# Altium schematic sheet PL_DDR4.SchDoc
size A3
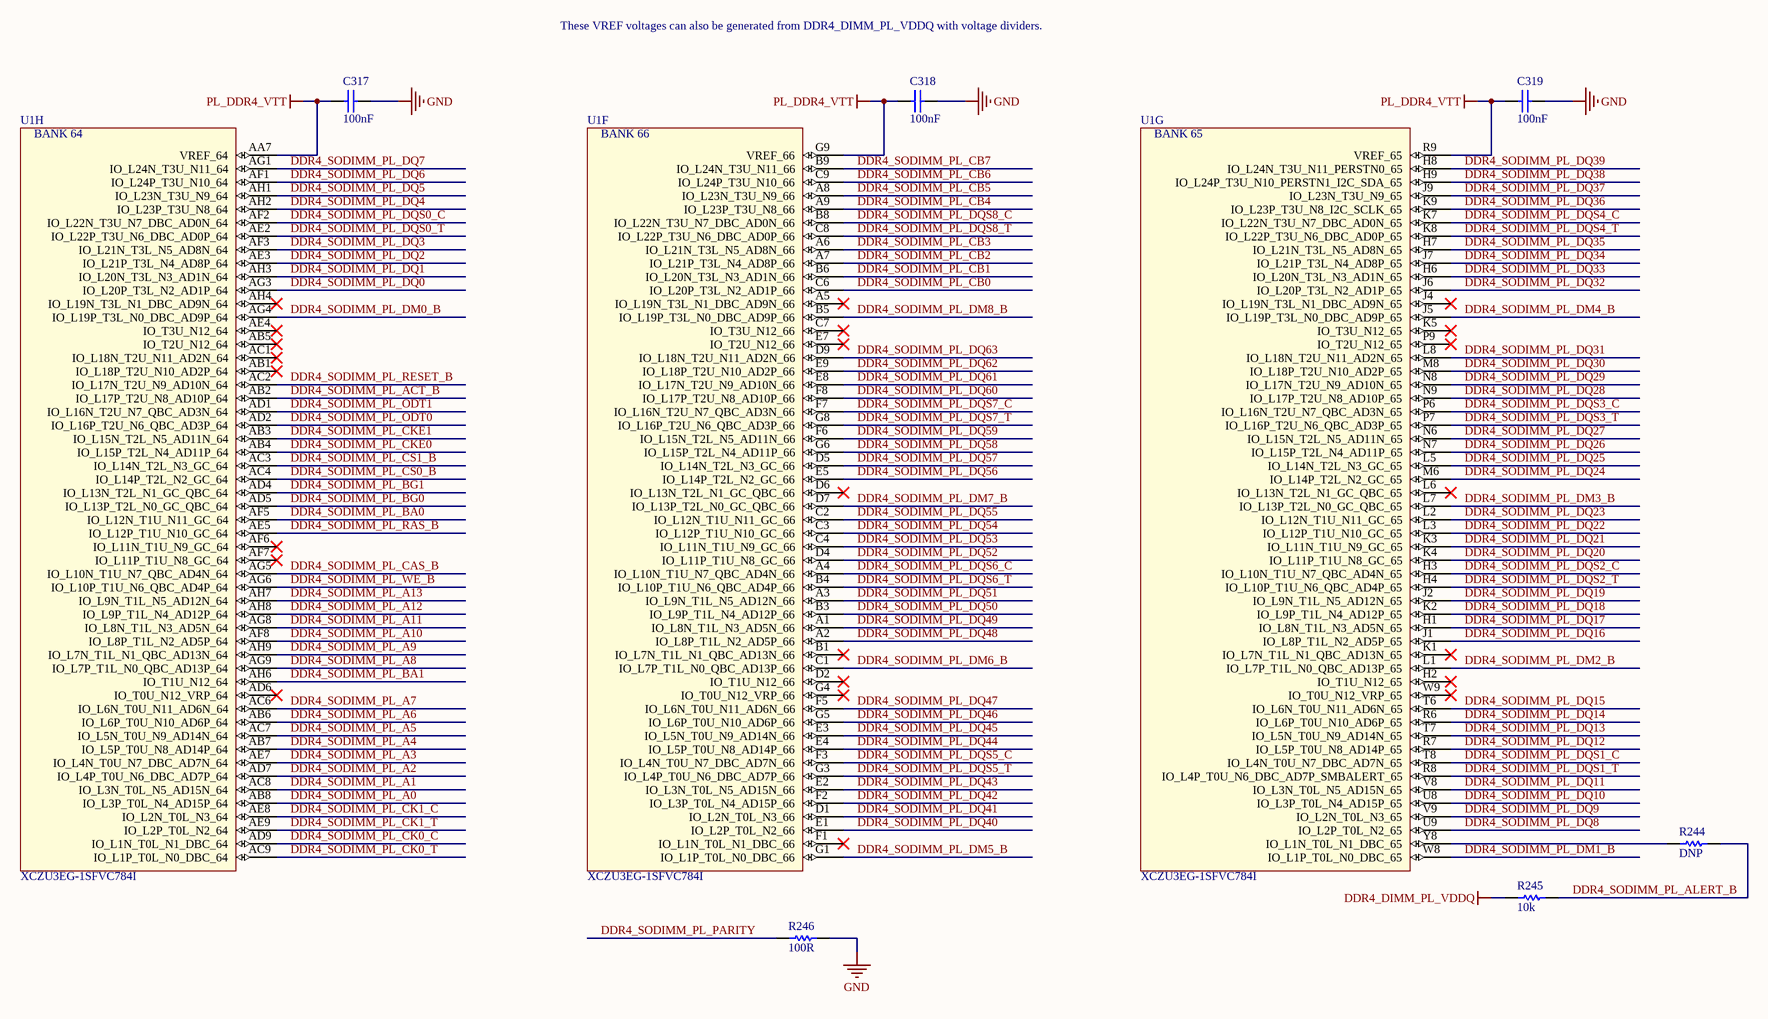
[diagram p0: PL_DDR4.SchDoc]

## Parts
C317  100nF  [CAPC1005L_0402]
C318  100nF  [CAPC1005L_0402]
C319  100nF  [CAPC1005L_0402]
R244  value DNP  [RESC1005L_0402]  (hidden comment: RES0402)
R245  value 10k  [RESC1005L_0402]  (hidden comment: RES0402_10K_0W1_05T)
R246  value 100R  [RESC1005L_0402]  (hidden comment: RES0402_100R_0W1_1T)
U1  XCZU3EG-1SFVC784I  [BGA784x28]  (parts F,G,H of 22)

## Nets
DDR4_DIMM_PL_VDDQ: R245.2
GND: C317.1 C318.1 C319.1 R246.2
PL_DDR4_VTT: C317.2 C318.2 C319.2 U1.AA7(VREF_64) U1.G9(VREF_66) U1.R9(VREF_65)
DDR4_SODIMM_PL_A0: U1.AB8(IO_L3P_T0L_N4_AD15P_64)
DDR4_SODIMM_PL_A1: U1.AC8(IO_L3N_T0L_N5_AD15N_64)
DDR4_SODIMM_PL_A2: U1.AD7(IO_L4P_T0U_N6_DBC_AD7P_64)
DDR4_SODIMM_PL_A3: U1.AE7(IO_L4N_T0U_N7_DBC_AD7N_64)
DDR4_SODIMM_PL_A4: U1.AB7(IO_L5P_T0U_N8_AD14P_64)
DDR4_SODIMM_PL_A5: U1.AC7(IO_L5N_T0U_N9_AD14N_64)
DDR4_SODIMM_PL_A6: U1.AB6(IO_L6P_T0U_N10_AD6P_64)
DDR4_SODIMM_PL_A7: U1.AC6(IO_L6N_T0U_N11_AD6N_64)
DDR4_SODIMM_PL_A8: U1.AG9(IO_L7P_T1L_N0_QBC_AD13P_64)
DDR4_SODIMM_PL_A9: U1.AH9(IO_L7N_T1L_N1_QBC_AD13N_64)
DDR4_SODIMM_PL_A10: U1.AF8(IO_L8P_T1L_N2_AD5P_64)
DDR4_SODIMM_PL_A11: U1.AG8(IO_L8N_T1L_N3_AD5N_64)
DDR4_SODIMM_PL_A12: U1.AH8(IO_L9P_T1L_N4_AD12P_64)
DDR4_SODIMM_PL_A13: U1.AH7(IO_L9N_T1L_N5_AD12N_64)
DDR4_SODIMM_PL_ACT_B: U1.AB2(IO_L17P_T2U_N8_AD10P_64)
DDR4_SODIMM_PL_ALERT_B: R244.2 R245.1
DDR4_SODIMM_PL_BA0: U1.AF5(IO_L12N_T1U_N11_GC_64)
DDR4_SODIMM_PL_BA1: U1.AH6(IO_T1U_N12_64)
DDR4_SODIMM_PL_BG0: U1.AD5(IO_L13P_T2L_N0_GC_QBC_64)
DDR4_SODIMM_PL_BG1: U1.AD4(IO_L13N_T2L_N1_GC_QBC_64)
DDR4_SODIMM_PL_CAS_B: U1.AG5(IO_L10N_T1U_N7_QBC_AD4N_64)
DDR4_SODIMM_PL_CB0: U1.C6(IO_L20P_T3L_N2_AD1P_66)
DDR4_SODIMM_PL_CB1: U1.B6(IO_L20N_T3L_N3_AD1N_66)
DDR4_SODIMM_PL_CB2: U1.A7(IO_L21P_T3L_N4_AD8P_66)
DDR4_SODIMM_PL_CB3: U1.A6(IO_L21N_T3L_N5_AD8N_66)
DDR4_SODIMM_PL_CB4: U1.A9(IO_L23P_T3U_N8_66)
DDR4_SODIMM_PL_CB5: U1.A8(IO_L23N_T3U_N9_66)
DDR4_SODIMM_PL_CB6: U1.C9(IO_L24P_T3U_N10_66)
DDR4_SODIMM_PL_CB7: U1.B9(IO_L24N_T3U_N11_66)
DDR4_SODIMM_PL_CK0_C: U1.AD9(IO_L1N_T0L_N1_DBC_64)
DDR4_SODIMM_PL_CK0_T: U1.AC9(IO_L1P_T0L_N0_DBC_64)
DDR4_SODIMM_PL_CK1_C: U1.AE8(IO_L2N_T0L_N3_64)
DDR4_SODIMM_PL_CK1_T: U1.AE9(IO_L2P_T0L_N2_64)
DDR4_SODIMM_PL_CKE0: U1.AB4(IO_L15P_T2L_N4_AD11P_64)
DDR4_SODIMM_PL_CKE1: U1.AB3(IO_L15N_T2L_N5_AD11N_64)
DDR4_SODIMM_PL_CS0_B: U1.AC4(IO_L14P_T2L_N2_GC_64)
DDR4_SODIMM_PL_CS1_B: U1.AC3(IO_L14N_T2L_N3_GC_64)
DDR4_SODIMM_PL_DM0_B: U1.AG4(IO_L19P_T3L_N0_DBC_AD9P_64)
DDR4_SODIMM_PL_DM1_B: U1.W8(IO_L1P_T0L_N0_DBC_65)
DDR4_SODIMM_PL_DM2_B: U1.L1(IO_L7P_T1L_N0_QBC_AD13P_65)
DDR4_SODIMM_PL_DM3_B: U1.L7(IO_L13P_T2L_N0_GC_QBC_65)
DDR4_SODIMM_PL_DM4_B: U1.J5(IO_L19P_T3L_N0_DBC_AD9P_65)
DDR4_SODIMM_PL_DM5_B: U1.G1(IO_L1P_T0L_N0_DBC_66)
DDR4_SODIMM_PL_DM6_B: U1.C1(IO_L7P_T1L_N0_QBC_AD13P_66)
DDR4_SODIMM_PL_DM7_B: U1.D7(IO_L13P_T2L_N0_GC_QBC_66)
DDR4_SODIMM_PL_DM8_B: U1.B5(IO_L19P_T3L_N0_DBC_AD9P_66)
DDR4_SODIMM_PL_DQ0: U1.AG3(IO_L20P_T3L_N2_AD1P_64)
DDR4_SODIMM_PL_DQ1: U1.AH3(IO_L20N_T3L_N3_AD1N_64)
DDR4_SODIMM_PL_DQ2: U1.AE3(IO_L21P_T3L_N4_AD8P_64)
DDR4_SODIMM_PL_DQ3: U1.AF3(IO_L21N_T3L_N5_AD8N_64)
DDR4_SODIMM_PL_DQ4: U1.AH2(IO_L23P_T3U_N8_64)
DDR4_SODIMM_PL_DQ5: U1.AH1(IO_L23N_T3U_N9_64)
DDR4_SODIMM_PL_DQ6: U1.AF1(IO_L24P_T3U_N10_64)
DDR4_SODIMM_PL_DQ7: U1.AG1(IO_L24N_T3U_N11_64)
DDR4_SODIMM_PL_DQ8: U1.U9(IO_L2P_T0L_N2_65)
DDR4_SODIMM_PL_DQ9: U1.V9(IO_L2N_T0L_N3_65)
DDR4_SODIMM_PL_DQ10: U1.U8(IO_L3P_T0L_N4_AD15P_65)
DDR4_SODIMM_PL_DQ11: U1.V8(IO_L3N_T0L_N5_AD15N_65)
DDR4_SODIMM_PL_DQ12: U1.R7(IO_L5P_T0U_N8_AD14P_65)
DDR4_SODIMM_PL_DQ13: U1.T7(IO_L5N_T0U_N9_AD14N_65)
DDR4_SODIMM_PL_DQ14: U1.R6(IO_L6P_T0U_N10_AD6P_65)
DDR4_SODIMM_PL_DQ15: U1.T6(IO_L6N_T0U_N11_AD6N_65)
DDR4_SODIMM_PL_DQ16: U1.J1(IO_L8P_T1L_N2_AD5P_65)
DDR4_SODIMM_PL_DQ17: U1.H1(IO_L8N_T1L_N3_AD5N_65)
DDR4_SODIMM_PL_DQ18: U1.K2(IO_L9P_T1L_N4_AD12P_65)
DDR4_SODIMM_PL_DQ19: U1.J2(IO_L9N_T1L_N5_AD12N_65)
DDR4_SODIMM_PL_DQ20: U1.K4(IO_L11P_T1U_N8_GC_65)
DDR4_SODIMM_PL_DQ21: U1.K3(IO_L11N_T1U_N9_GC_65)
DDR4_SODIMM_PL_DQ22: U1.L3(IO_L12P_T1U_N10_GC_65)
DDR4_SODIMM_PL_DQ23: U1.L2(IO_L12N_T1U_N11_GC_65)
DDR4_SODIMM_PL_DQ24: U1.M6(IO_L14P_T2L_N2_GC_65)
DDR4_SODIMM_PL_DQ25: U1.L5(IO_L14N_T2L_N3_GC_65)
DDR4_SODIMM_PL_DQ26: U1.N7(IO_L15P_T2L_N4_AD11P_65)
DDR4_SODIMM_PL_DQ27: U1.N6(IO_L15N_T2L_N5_AD11N_65)
DDR4_SODIMM_PL_DQ28: U1.N9(IO_L17P_T2U_N8_AD10P_65)
DDR4_SODIMM_PL_DQ29: U1.N8(IO_L17N_T2U_N9_AD10N_65)
DDR4_SODIMM_PL_DQ30: U1.M8(IO_L18P_T2U_N10_AD2P_65)
DDR4_SODIMM_PL_DQ31: U1.L8(IO_L18N_T2U_N11_AD2N_65)
DDR4_SODIMM_PL_DQ32: U1.J6(IO_L20P_T3L_N2_AD1P_65)
DDR4_SODIMM_PL_DQ33: U1.H6(IO_L20N_T3L_N3_AD1N_65)
DDR4_SODIMM_PL_DQ34: U1.J7(IO_L21P_T3L_N4_AD8P_65)
DDR4_SODIMM_PL_DQ35: U1.H7(IO_L21N_T3L_N5_AD8N_65)
DDR4_SODIMM_PL_DQ36: U1.K9(IO_L23P_T3U_N8_I2C_SCLK_65)
DDR4_SODIMM_PL_DQ37: U1.J9(IO_L23N_T3U_N9_65)
DDR4_SODIMM_PL_DQ38: U1.H9(IO_L24P_T3U_N10_PERSTN1_I2C_SDA_65)
DDR4_SODIMM_PL_DQ39: U1.H8(IO_L24N_T3U_N11_PERSTN0_65)
DDR4_SODIMM_PL_DQ40: U1.E1(IO_L2P_T0L_N2_66)
DDR4_SODIMM_PL_DQ41: U1.D1(IO_L2N_T0L_N3_66)
DDR4_SODIMM_PL_DQ42: U1.F2(IO_L3P_T0L_N4_AD15P_66)
DDR4_SODIMM_PL_DQ43: U1.E2(IO_L3N_T0L_N5_AD15N_66)
DDR4_SODIMM_PL_DQ44: U1.E4(IO_L5P_T0U_N8_AD14P_66)
DDR4_SODIMM_PL_DQ45: U1.E3(IO_L5N_T0U_N9_AD14N_66)
DDR4_SODIMM_PL_DQ46: U1.G5(IO_L6P_T0U_N10_AD6P_66)
DDR4_SODIMM_PL_DQ47: U1.F5(IO_L6N_T0U_N11_AD6N_66)
DDR4_SODIMM_PL_DQ48: U1.A2(IO_L8P_T1L_N2_AD5P_66)
DDR4_SODIMM_PL_DQ49: U1.A1(IO_L8N_T1L_N3_AD5N_66)
DDR4_SODIMM_PL_DQ50: U1.B3(IO_L9P_T1L_N4_AD12P_66)
DDR4_SODIMM_PL_DQ51: U1.A3(IO_L9N_T1L_N5_AD12N_66)
DDR4_SODIMM_PL_DQ52: U1.D4(IO_L11P_T1U_N8_GC_66)
DDR4_SODIMM_PL_DQ53: U1.C4(IO_L11N_T1U_N9_GC_66)
DDR4_SODIMM_PL_DQ54: U1.C3(IO_L12P_T1U_N10_GC_66)
DDR4_SODIMM_PL_DQ55: U1.C2(IO_L12N_T1U_N11_GC_66)
DDR4_SODIMM_PL_DQ56: U1.E5(IO_L14P_T2L_N2_GC_66)
DDR4_SODIMM_PL_DQ57: U1.D5(IO_L14N_T2L_N3_GC_66)
DDR4_SODIMM_PL_DQ58: U1.G6(IO_L15P_T2L_N4_AD11P_66)
DDR4_SODIMM_PL_DQ59: U1.F6(IO_L15N_T2L_N5_AD11N_66)
DDR4_SODIMM_PL_DQ60: U1.F8(IO_L17P_T2U_N8_AD10P_66)
DDR4_SODIMM_PL_DQ61: U1.E8(IO_L17N_T2U_N9_AD10N_66)
DDR4_SODIMM_PL_DQ62: U1.E9(IO_L18P_T2U_N10_AD2P_66)
DDR4_SODIMM_PL_DQ63: U1.D9(IO_L18N_T2U_N11_AD2N_66)
DDR4_SODIMM_PL_DQS0_C: U1.AF2(IO_L22N_T3U_N7_DBC_AD0N_64)
DDR4_SODIMM_PL_DQS0_T: U1.AE2(IO_L22P_T3U_N6_DBC_AD0P_64)
DDR4_SODIMM_PL_DQS1_C: U1.T8(IO_L4N_T0U_N7_DBC_AD7N_65)
DDR4_SODIMM_PL_DQS1_T: U1.R8(IO_L4P_T0U_N6_DBC_AD7P_SMBALERT_65)
DDR4_SODIMM_PL_DQS2_C: U1.H3(IO_L10N_T1U_N7_QBC_AD4N_65)
DDR4_SODIMM_PL_DQS2_T: U1.H4(IO_L10P_T1U_N6_QBC_AD4P_65)
DDR4_SODIMM_PL_DQS3_C: U1.P6(IO_L16N_T2U_N7_QBC_AD3N_65)
DDR4_SODIMM_PL_DQS3_T: U1.P7(IO_L16P_T2U_N6_QBC_AD3P_65)
DDR4_SODIMM_PL_DQS4_C: U1.K7(IO_L22N_T3U_N7_DBC_AD0N_65)
DDR4_SODIMM_PL_DQS4_T: U1.K8(IO_L22P_T3U_N6_DBC_AD0P_65)
DDR4_SODIMM_PL_DQS5_C: U1.F3(IO_L4N_T0U_N7_DBC_AD7N_66)
DDR4_SODIMM_PL_DQS5_T: U1.G3(IO_L4P_T0U_N6_DBC_AD7P_66)
DDR4_SODIMM_PL_DQS6_C: U1.A4(IO_L10N_T1U_N7_QBC_AD4N_66)
DDR4_SODIMM_PL_DQS6_T: U1.B4(IO_L10P_T1U_N6_QBC_AD4P_66)
DDR4_SODIMM_PL_DQS7_C: U1.F7(IO_L16N_T2U_N7_QBC_AD3N_66)
DDR4_SODIMM_PL_DQS7_T: U1.G8(IO_L16P_T2U_N6_QBC_AD3P_66)
DDR4_SODIMM_PL_DQS8_C: U1.B8(IO_L22N_T3U_N7_DBC_AD0N_66)
DDR4_SODIMM_PL_DQS8_T: U1.C8(IO_L22P_T3U_N6_DBC_AD0P_66)
DDR4_SODIMM_PL_ODT0: U1.AD2(IO_L16P_T2U_N6_QBC_AD3P_64)
DDR4_SODIMM_PL_ODT1: U1.AD1(IO_L16N_T2U_N7_QBC_AD3N_64)
DDR4_SODIMM_PL_PARITY: R246.1
DDR4_SODIMM_PL_RAS_B: U1.AE5(IO_L12P_T1U_N10_GC_64)
DDR4_SODIMM_PL_RESET_B: U1.AC2(IO_L17N_T2U_N9_AD10N_64)
DDR4_SODIMM_PL_WE_B: U1.AG6(IO_L10P_T1U_N6_QBC_AD4P_64)
NetR244_1: R244.1 U1.Y8(IO_L1N_T0L_N1_DBC_65)

Not connected (* = marked no-connect by the designer): U1 A5(IO_L19N_T3L_N1_DBC_AD9N_66)* AB1(IO_L18P_T2U_N10_AD2P_64)* AB5(IO_T2U_N12_64)* AC1(IO_L18N_T2U_N11_AD2N_64)* AD6(IO_T0U_N12_VRP_64)* AE4(IO_T3U_N12_64)* AF6(IO_L11N_T1U_N9_GC_64)* AF7(IO_L11P_T1U_N8_GC_64)* AH4(IO_L19N_T3L_N1_DBC_AD9N_64)* B1(IO_L7N_T1L_N1_QBC_AD13N_66)* C7(IO_T3U_N12_66)* D2(IO_T1U_N12_66)* D6(IO_L13N_T2L_N1_GC_QBC_66)* E7(IO_T2U_N12_66)* F1(IO_L1N_T0L_N1_DBC_66)* G4(IO_T0U_N12_VRP_66)* H2(IO_T1U_N12_65)* J4(IO_L19N_T3L_N1_DBC_AD9N_65)* K1(IO_L7N_T1L_N1_QBC_AD13N_65)* K5(IO_T3U_N12_65)* L6(IO_L13N_T2L_N1_GC_QBC_65)* P9(IO_T2U_N12_65)* W9(IO_T0U_N12_VRP_65)*

## Notes on the sheet
- These VREF voltages can also be generated from DDR4_DIMM_PL_VDDQ with voltage dividers.
- https://www.xilinx.com/support/answers/69779.html
- (in symbol XCZU3EG-1SFVC784I, part F) BANK 66
- (in symbol XCZU3EG-1SFVC784I, part G) BANK 65
- (in symbol XCZU3EG-1SFVC784I, part H) BANK 64

## Library data of the parts
C317-C319 = CAPCER0402X7R100N25V_10T: CAP CER 0.1UF 25V X7R 0402; Manufacturer 1: Murata Electronics North America; Manufacturer Part Number 1: GRM155R71E104KE14D; Tolerance: 10%; Package: 0402; ComponentLink1Description: Datasheet; Value: 100nF; Voltage: 25V; Temperature Coefficient: X7R; Supplier 1: Digi-Key; Supplier Part Number 1: 490-10698-1-ND; Operating Temperature: -55°C ~ 125°C
R244 = RES0402: RES SMD 0402 Footprint; Package: 0402; ComponentLink1Description: Datasheet; Tolerance: -
R245 = RES0402_10K_0W1_05T: RES SMD 10K OHM 0.5% 1/16W 0402; Manufacturer 1: Panasonic Electronic Components; Manufacturer Part Number 1: ERJ-2RHD1002X; Package: 0402; ComponentLink1Description: Datasheet; Power: 1/16W; Tolerance: 0.5%; Supplier 1: Digi-Key; Supplier Part Number 1: P15984CT-ND
R246 = RES0402_100R_0W1_1T: RES SMD 100 OHM 1% 1/10W 0402; Manufacturer 1: Panasonic Electronic Components; Manufacturer Part Number 1: ERJ-2RKF1000X; Package: 0402; ComponentLink1Description: Datasheet; Power: 1/10W; Tolerance: 1%; Supplier 1: Digi-Key; Supplier Part Number 1: P100LCT-ND
U1 = XCZU3EG-1SFVC784I: IC FPGA 252 I/O 784FCBGA - XILINX ZYNQ ULTRASCALE+; Manufacturer 1: Xilinx Inc.; Package: SFVC784; ComponentLink1Description: Datasheet; Supplier 1: Digi-Key; Supplier Part Number 1: XCZU3EG-1SFVC784I-ND; Manufacturer Part Number 1: XCZU3EG-1SFVC784I